# Altium schematic sheet Sheet1.SchDoc
size A4
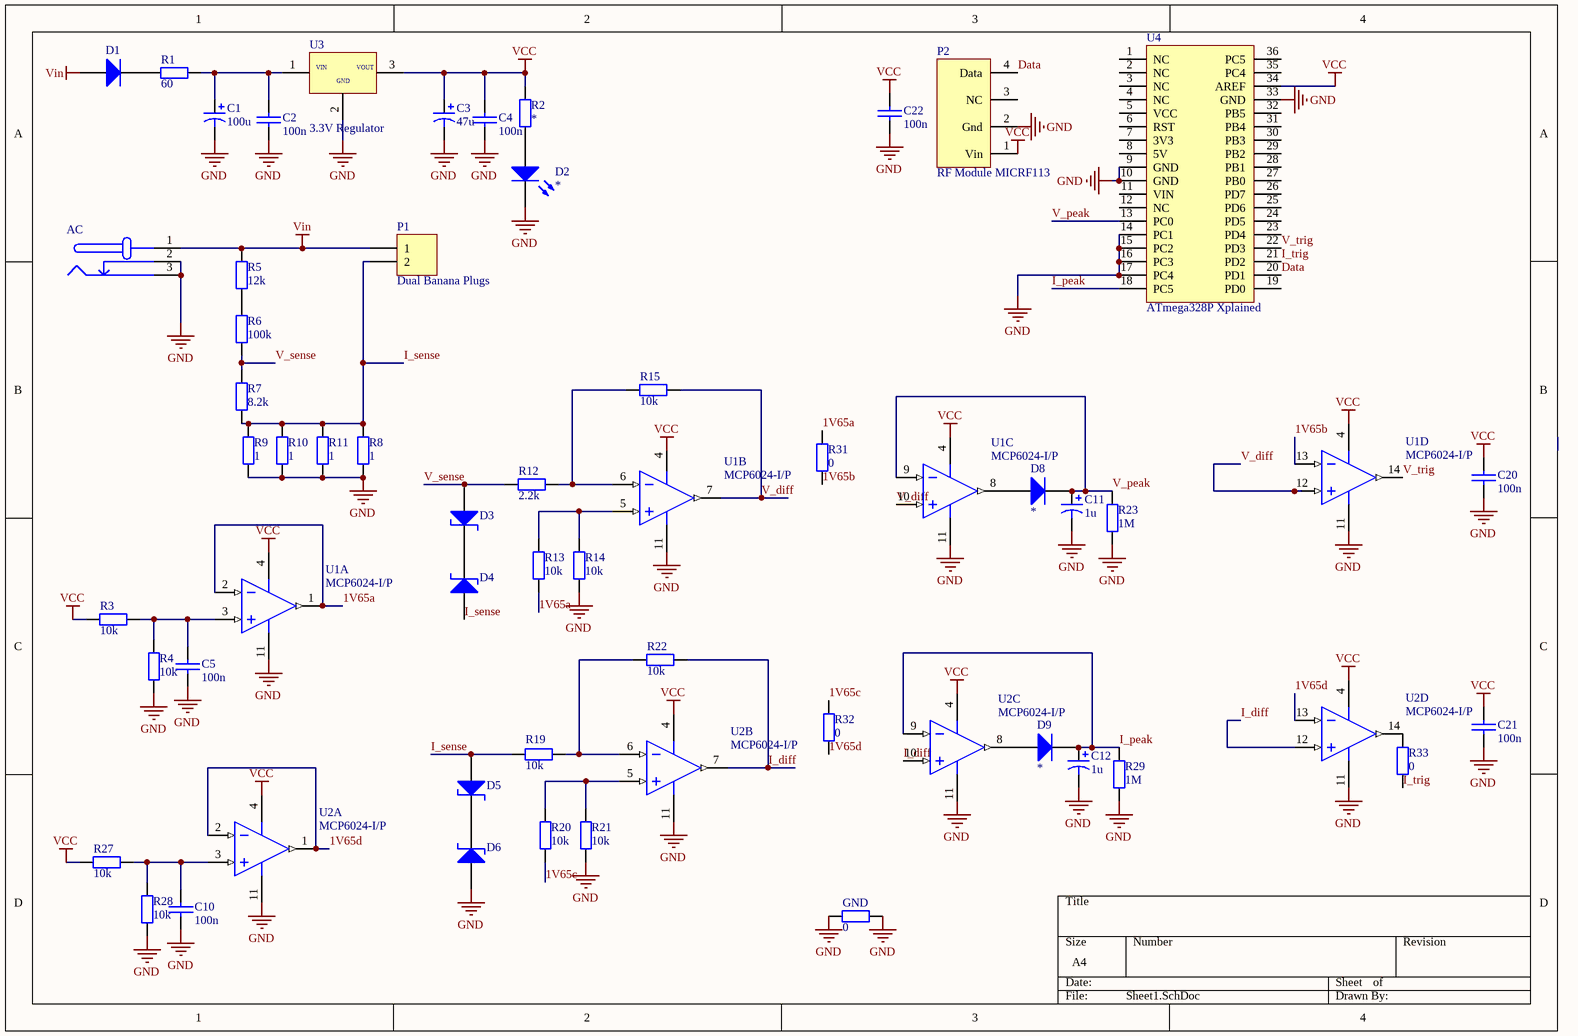
[diagram p0: Sheet1.SchDoc]

## Parts
AC  (no value)  [AC-Socket]
C1  100u  [CAP-RAD-3mm Pitch]
C2  100n  [FILM CAP-0.2]
C3  47u  [CAP-RAD-3mm Pitch]
C4  100n  [FILM CAP-0.2]
C5  100n  [FILM CAP-0.2]
C10  100n  [FILM CAP-0.2]
C11  1u  [CAP-RAD-2mm Pitch]
C12  1u  [CAP-RAD-2mm Pitch]
C20  100n  [FILM CAP-0.2]
C21  100n  [FILM CAP-0.2]
C22  100n  [FILM CAP-0.2]
D1  (no value)  [AXIAL-DIODE-0.4]
D2  *  [LED]
D3  (no value)  [AXIAL-DIODE-0.4]
D4  (no value)  [AXIAL-DIODE-0.4]
D5  (no value)  [AXIAL-DIODE-0.4]
D6  (no value)  [AXIAL-DIODE-0.4]
D8  *  [AXIAL-DIODE-0.4]
D9  *  [AXIAL-DIODE-0.4]
GND  0  [AXIAL-0.4]
P1  Dual Banana Plugs  [Dual Banana Plug]
P2  RF Module MICRF113  [MICRF113 TX]
R1  60  [AXIAL-0.4]
R2  *  [AXIAL-0.4]
R3  10k  [AXIAL-0.4]
R4  10k  [AXIAL-0.4]
R5  12k  [AXIAL-0.4]
R6  100k  [AXIAL-0.4]
R7  8.2k  [AXIAL-0.4]
R8  1  [AXIAL-0.4]
R9  1  [AXIAL-0.4]
R10  1  [AXIAL-0.4]
R11  1  [AXIAL-0.4]
R12  2.2k  [AXIAL-0.4]
R13  10k  [AXIAL-0.4]
R14  10k  [AXIAL-0.4]
R15  10k  [AXIAL-0.4]
R19  10k  [AXIAL-0.4]
R20  10k  [AXIAL-0.4]
R21  10k  [AXIAL-0.4]
R22  10k  [AXIAL-0.4]
R23  1M  [AXIAL-0.4]
R27  10k  [AXIAL-0.4]
R28  10k  [AXIAL-0.4]
R29  1M  [AXIAL-0.4]
R31  0  [AXIAL-0.4]
R32  0  [AXIAL-0.4]
R33  0  [AXIAL-0.4]
U1  MCP6024-I/P  [DIP-14]  (parts A,B,C,D of 4)
U2  MCP6024-I/P  [DIP-14]  (parts A,B,C,D of 4)
U3  3.3V Regulator  [TO-92]
U4  ATmega328P Xplained  [ATmeg328P Xplained]

## Nets
GND: AC.2(GND_ALT) AC.3(GND) C1.2 C2.2 C3.2 C4.2 C5.2 C10.2 C11.2 C12.2 C20.2 C21.2 C22.2 D2.2(K) D6.1(A) GND.1 GND.2 P2.2(Gnd) R4.1 R8.1 R9.1 R10.1 R11.1 R14.1 R21.1 R23.1 R28.1 R29.1 U1.11(VSS) U2.11(VSS) U3.2(GND) U4.9(GND) U4.10(GND) U4.14(PC1) U4.15(PC2) U4.16(PC3) U4.17(PC4) U4.33(GND)
VCC: C3.1 C4.1 C20.1 C21.1 C22.1 P2.1(Vin) R2.2 R3.1 R27.1 U1.4(VDD) U2.4(VDD) U3.3(OUTPUT) U4.34(AREF)
Vin: AC.1(VCC) D1.1(A) P1.1 R5.2
1V65a: R13.1 R31.2 U1.1(VOUTA) U1.2(VINA-)
1V65b: R31.1 U1.13(VIND-)
1V65c: R20.1 R32.2
1V65d: R32.1 U2.1(VOUTA) U2.2(VINA-) U2.13(VIND-)
Data: P2.4(Data) U4.20(PD1)
I_diff: R22.2 U2.7(VOUTB) U2.10(VINC+) U2.12(VIND+)
I_peak: C12.1 D9.2(K) R29.2 U2.9(VINC-) U4.18(PC5)
I_sense: D4.1(A) D5.1(A) P1.2 R7.1 R8.2 R9.2 R10.2 R11.2 R19.1
I_trig: R33.1 U4.21(PD2)
V_diff: R15.2 U1.7(VOUTB) U1.10(VINC+) U1.12(VIND+)
V_peak: C11.1 D8.2(K) R23.2 U1.9(VINC-) U4.13(PC0)
V_sense: D3.1(A) R6.1 R7.2 R12.1
V_trig: U1.14(VOUTD) U4.22(PD3)
NetC1_1: C1.1 C2.1 R1.2 U3.1(INPUT)
NetC5_1: C5.1 R3.2 R4.2 U1.3(VINA+)
NetC10_1: C10.1 R27.2 R28.2 U2.3(VINA+)
NetD1_2: D1.2(K) R1.1
NetD2_1: D2.1(A) R2.1
NetD3_2: D3.2(K) D4.2(K)
NetD5_2: D5.2(K) D6.2(K)
NetD8_1: D8.1(A) U1.8(VOUTC)
NetD9_1: D9.1(A) U2.8(VOUTC)
NetR5_1: R5.1 R6.2
NetR12_2: R12.2 R15.1 U1.6(VINB-)
NetR13_2: R13.2 R14.2 U1.5(VINB+)
NetR19_2: R19.2 R22.1 U2.6(VINB-)
NetR20_2: R20.2 R21.2 U2.5(VINB+)
NetR33_2: R33.2 U2.14(VOUTD)

Not connected (* = marked no-connect by the designer): P2 3(NC); U4 1(NC) 2(NC) 3(NC) 4(NC) 5(VCC) 6(RST) 7(3V3) 8(5V) 11(VIN) 12(NC) 19(PD0) 23(PD4) 24(PD5) 25(PD6) 26(PD7) 27(PB0) 28(PB1) 29(PB2) 30(PB3) 31(PB4) 32(PB5) 35(PC4) 36(PC5)

## Notes on the sheet
- Labels drawn without touching a wire or pin: VCC
- (in symbol LP2950-33) VIN; VOUT

## Library data of the parts
AC = AC Input: DC socket
C1 C3 = Cap Pol (22uF-100uF): Polarized Capacitor (Axial); Published: 8-Jun-2000; LatestRevisionDate: 17-Jul-2002; LatestRevisionNote: Re-released for DXP Platform.; PackageReference: POLAR0.8; Publisher: Altium Limited; PackageDescription: Polarized Capacitor; 2 Leads; Value: *
C2 C4 C5 C10 C20-C22 = CAP: Capacitor Non Polarised Through Hole
  C2 C4 C5 C10: Value: 100n
  C20-C22: Value: *
C11 C12 = Cap Pol (1uF-10uF): Polarized Capacitor (Axial); Published: 8-Jun-2000; LatestRevisionDate: 17-Jul-2002; LatestRevisionNote: Re-released for DXP Platform.; PackageReference: POLAR0.8; Publisher: Altium Limited; PackageDescription: Polarized Capacitor; 2 Leads; Value: *
D1 D8 D9 = Diode: Manufacturer: Fairchild Semiconductor; Revision 1: 11-July-2000: SIM Model Added.; Revision 2: July-2002: Re-released for DXP Platform.; Class I: Discrete; Class II: Diode - Switching; Published: 8-Jun-2000; Datasheet: Latest Revision: 1997; Package Reference: DO-35; Publisher: Altium Limited
  D8 D9: Value: *
D2 = LED: Typical GaAs LED; Manufacturer: Generic Components; Class I: Optoelectronic; Published: 8-Jun-2000; Revision: July-2002: Re-released for DXP Platform.; Publisher: Altium Limited; Class II: LED; Value: *
D3-D6 = Zener: Zener Diode
GND R1-R15 R19-R23 R27-R29 R31-R33 = Res: Through Hole Resistor; Published: 8-Jun-2000; LatestRevisionDate: 17-Jul-2002; LatestRevisionNote: Re-released for DXP Platform.; PackageReference: AXIAL-0.4; Publisher: Altium Limited
  GND R2 R12-R15 R19-R23 R29 R31-R33: Value: *
  R1: Value: 60
  R3 R4 R27 R28: Value: 10k
  R5: Value: 12k
  R6: Value: 100k
  R7: Value: 8.2k
  R8-R11: Value: 1
P1 = Dual Banana Plugs: M6 Holes; LatestRevisionDate: 17-Jul-2002; LatestRevisionNote: Re-released for DXP Platform.; Publisher: Altium Limited
P2 = RF Module: Vertical Mount RF Module
U1 U2 = MCP6024-I/P: Rail-to-Rail Input/Output, 10 MHz Operational Amplifier, 14-Pin PDIP, Industrial Temperature; FirstPublished: 29-Jan-2009; LatestRevisionDate: 02-Dec-2009; LatestRevisionNote: Updated to datasheet revision D, Feb-2009; DatasheetVersion: revD, Feb-2009; PackageVersion: revBB, Aug-2009; PackageReference: PDIP300-P14; Publisher: Altium Limited; PackageDescription: 14-Lead Plastic Dual In-Line (P) - 300 mil Body [PDIP]; ComponentLink1Description: Datasheet; ComponentLink1URL: http://ww1.microchip.com/downloads/en/DeviceDoc/21685d.pdf; ComponentLink2Description: Packaging Specification; ComponentLink2URL: http://www.microchip.com/stellent/groups/techpub_sg/documents/packagingspec/en012702.pdf; ComponentLink3Description: Microchip.com Home; ComponentLink3URL: http://www.microchip.com/
U3 = LP2950-33
U4 = ATmega328P Xplained: Header, 18-Pin, Dual row; LatestRevisionDate: 17-Jul-2002; LatestRevisionNote: Re-released for DXP Platform.; Publisher: Altium Limited